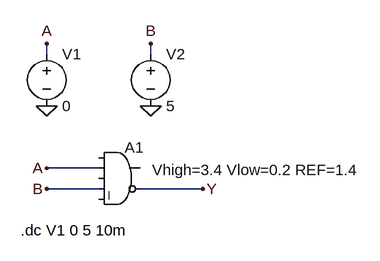
[diagram p0: schematic Draft2.asc]
Draft2.asc, the LTspice schematic file:
Version 4.1
SHEET 1 880 680
WIRE 96 -32 96 -48
WIRE 256 -32 256 -48
WIRE 176 144 96 144
WIRE 176 176 96 176
WIRE 336 176 240 176
FLAG 336 176 Y
FLAG 96 144 A
FLAG 96 176 B
FLAG 96 48 0
FLAG 256 48 0
FLAG 96 -48 A
FLAG 256 -48 B
SYMBOL Digital\\and 208 96 R0
WINDOW 39 50 51 Left 2
SYMATTR InstName A1
SYMATTR SpiceLine Vhigh=3.4 Vlow=0.2 REF=1.4
SYMBOL voltage 96 -48 R0
SYMATTR InstName V1
SYMATTR Value 0
SYMBOL voltage 256 -48 R0
SYMATTR InstName V2
SYMATTR Value 5
TEXT 56 240 Left 2 !.dc V1 0 5 10m

The netlist it stands for:
* Draft2.asc
A1 0 A 0 B 0 Y 0 0 AND Vhigh=3.4 Vlow=0.2 REF=1.4
V1 A 0 0
V2 B 0 5
.dc V1 0 5 10m
.backanno
.end